# EAGLE design amp_schematic1 (EAGLE 9.0.1)
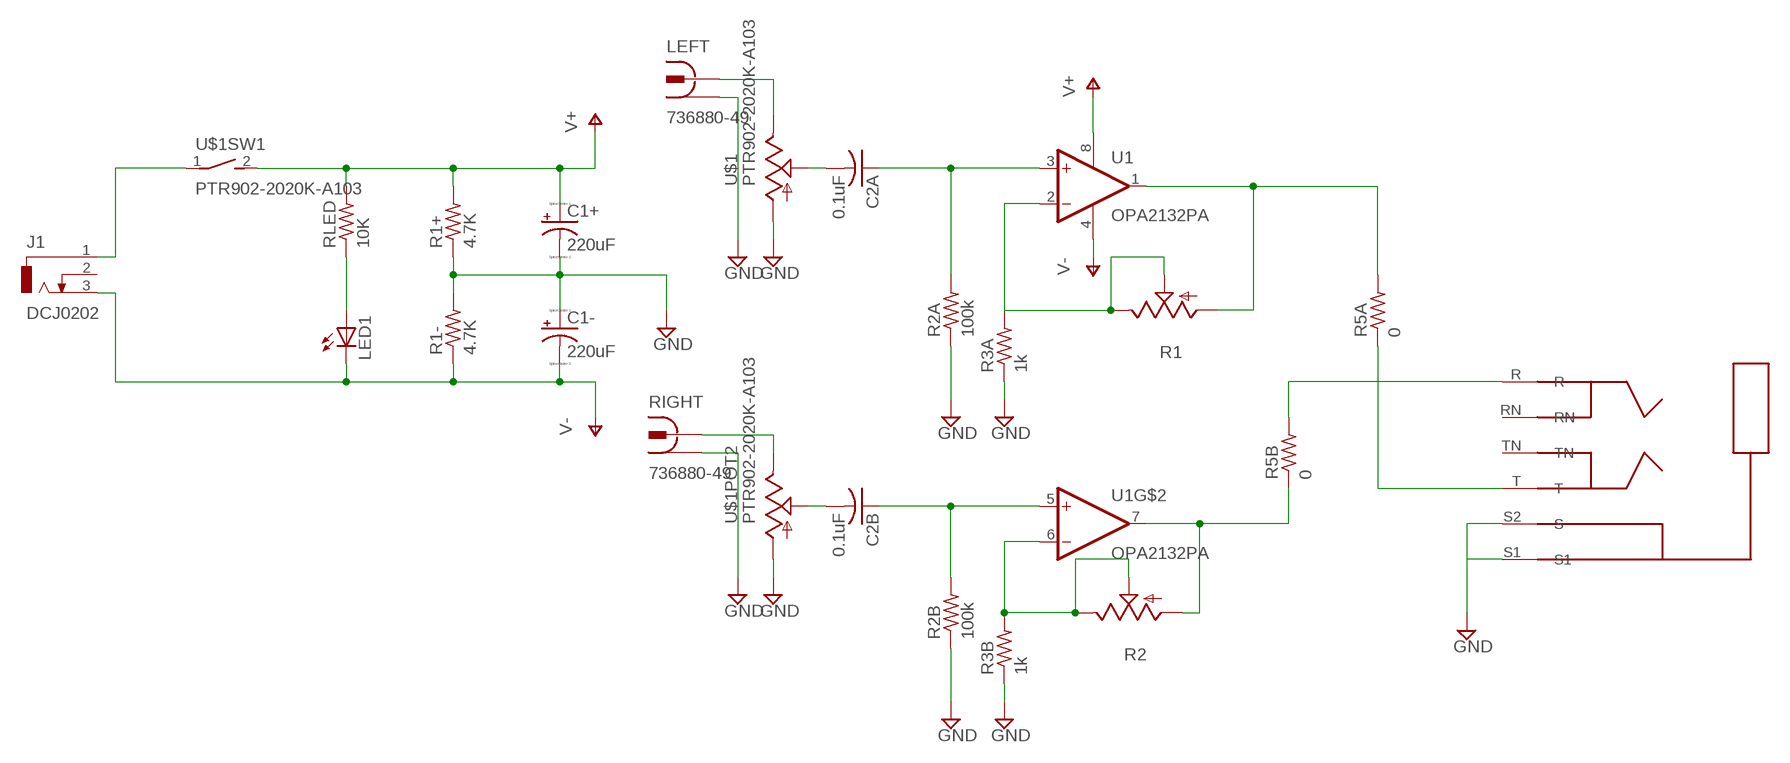
[diagram p0: schematic, sheet 1]

## Parts
C1+  220uF  CPOL-USE3.5-8  [E3,5-8]
C1-  220uF  CPOL-USE3.5-8  [E3,5-8]
C2A  0.1uF  C-US050-025X075  [C050-025X075]
C2B  0.1uF  C-US050-025X075  [C050-025X075]
J1  DCJ0202  [DCJ0202]
LED1  LED5MM  [LED5MM]
LEFT  736880-49  [736880-49]
R1  TRIM_US-B25U  [B25U]
R1+  4.7K  R-US_0204/2V  [0204V]
R1-  4.7K  R-US_0204/2V  [0204V]
R2  TRIM_US-B25U  [B25U]
R2A  100k  R-US_0204/2V  [0204V]
R2B  100k  R-US_0204/2V  [0204V]
R3A  1k  R-US_0204/2V  [0204V]
R3B  1k  R-US_0204/2V  [0204V]
R5A  0  R-US_0204/2V  [0204V]
R5B  0  R-US_0204/2V  [0204V]
RIGHT  736880-49  [736880-49]
RLED  10K  R-US_0204/2V  [0204V]
U1  OPA2132PA  [DIP254P762X508-8]
U$1  PTR902-2020K-A103  [PTR902]
U$2  STEROJACK  [STEREOJACK]

## Nets
GND: C1+.- C1-.+ LEFT.1 LEFT.1@1 LEFT.1@2 R1+.1 R1-.2 R2A.1 R2B.1 R3A.1 R3B.1 RIGHT.1 RIGHT.1@1 RIGHT.1@2 U$1.1A(A) U$1.1B(A) U$2.S1 U$2.S2(S)
N$1: LED1.A RLED.1
N$2: C2A.2 U$1.2A(S)
N$3: C2B.1 R2B.2 U1.5(+INB)
N$4: C2A.1 R2A.2 U1.3(+INA)
N$5: R1.E R1.S R3A.2 U1.2(-INA)
N$6: C2B.2 U$1.2B(S)
N$7: R2.E R2.S R3B.2 U1.6(-INB)
N$8: LEFT.2 U$1.3A(E)
N$9: R5B.2 U$2.R
N$10: RIGHT.2 U$1.3B(E)
N$11: R5A.1 U$2.T
N$13: R2.A R5B.1 U1.7(OUTB)
N$15: R1.A R5A.2 U1.1(OUTA)
SW1: J1.1 U$1.1(P)
V+: C1+.+ R1+.2 RLED.2 U1.8(V+) U$1.2(S)
V-: C1-.- J1.3 LED1.K(C) R1-.1 U1.4(V-)
Unconnected: J1.2 U$2.RN U$2.TN

## Library data of the parts
C1+ C1- = resistor:CPOL-US: POLARIZED CAPACITOR, American symbol
C2A C2B = rcl:C-US: CAPACITOR, American symbol; SPICEPREFIX: C
J1 = con-jack:DCJ0202: DC POWER JACK Source: DCJ0202.pdf; OC_FARNELL: unknown; OC_NEWARK: unknown
LED1 = led:LED: LED OSRAM: - CHIPLED LG R971, LG N971, LY N971, LG Q971, LY Q971, LO R971, LY R971 LH N974, LH R974 LS Q976, LO Q976, LY Q976 LO Q996 - Hyper CHIPLED LW Q18S LB Q993, LB Q99A, LB R99A - SideLED LS A670, LO A670, LY A670, LG A670, LP A670 LB A673, LV A673, LT A673, LW A673 LH A674 LY A675 LS A676, LA A676, LO A676, LY A676, LW A676 LS A679, LY A679, LG A679 - Hyper Micro SIDELED® LS Y876, LA Y876, LO Y876, LY Y876 LT Y87S - SmartLED LW L88C, LW L88S LB L89C, LB L89S, LG L890 LS L89K, LO L89K, LY L89K LS L896, LA L896, LO L896, LY L896 - TOPLED LS T670, LO T670, LY T670, LG T670, LP T670 LSG T670, LSP T670, LSY T670, LOP T670, LYG T670 LG T671, LOG T671, LSG T671 LB T673, LV T673, LT T673, LW T673 LH T674 LS T676, LA T676, LO T676, LY T676, LB T676, LH T676, LSB T676, LW T676 LB T67C, LV T67C, LT T67C, LS T67K, LO T67K, LY T67K, LW E67C LS E67B, LA E67B, LO E67B, LY E67B, LB E67C, LV E67C, LT E67C LW T67C LS T679, LY T679, LG T679 LS T770, LO T770, LY T770, LG T770, LP T770 LB T773, LV T773, LT T773, LW T773 LH T774 LS E675, LA E675, LY E675, LS T675 LS T776, LA T776, LO T776, LY T776, LB T776 LHGB T686 LT T68C, LB T68C - Hyper Mini TOPLED® LB M676 - Mini TOPLED Santana® LG M470 LS M47K, LO M47K, LY M47K Source: http://www.osram.convergy.de LUXEON: - LUMILED® LXK2-PW12-R00, LXK2-PW12-S00, LXK2-PW14-U00, LXK2-PW14-V00 LXK2-PM12-R00, LXK2-PM12-S00, LXK2-PM14-U00 LXK2-PE12-Q00, LXK2-PE12-R00, LXK2-PE12-S00, LXK2-PE14-T00, LXK2-PE14-U00 LXK2-PB12-K00, LXK2-PB12-L00, LXK2-PB12-M00, LXK2-PB14-N00, LXK2-PB14-P00, LXK2-PB14-Q00 LXK2-PR12-L00, LXK2-PR12-M00, LXK2-PR14-Q00, LXK2-PR14-R00 LXK2-PD12-Q00, LXK2-PD12-R00, LXK2-PD12-S00 LXK2-PH12-R00, LXK2-PH12-S00 LXK2-PL12-P00, LXK2-PL12-Q00, LXK2-PL12-R00 Source: www.luxeon.com KINGBRIGHT: KA-3528ASYC Source: www.kingbright.com
LEFT RIGHT = con-conrad:736880-49: Cinch Connector ( RCA Jack ) Cinch-Einbaukupplung 90º 72345 Vernickelt BKL Electronic Source: Conrad <http://www.conrad.de/ce/de/product/736880>
R1 R2 = pot:TRIM_US-: POTENTIOMETER
R1+ R1- R2A R2B R3A R3B R5A R5B RLED = resistor:R-US_: RESISTOR, American symbol
U1 = OPA2132PA:OPA2132PA: OPERATIONAL AMPLIFIER; DESCRIPTION: Operational amplifier; 8MHz; 2.5÷18VDC; Channels: 2; DIP8; DIGI-KEY_PART_NUMBER: OPA2132PA-ND; DIGI-KEY_PURCHASE_URL: https://www.digikey.com/product-detail/en/texas-instruments/OPA2132PA/OPA2132PA-ND/301149?utm_source=snapeda&utm_medium=aggregator&utm_campaign=symbol; MF: Texas Instruments; MP: OPA2132PA; PACKAGE: PDIP-8 Texas Instruments
U$1 = OPA2132PA:PTR902-2020K-A103
U$2 = OPA2132PA:STEROJACK

## Board
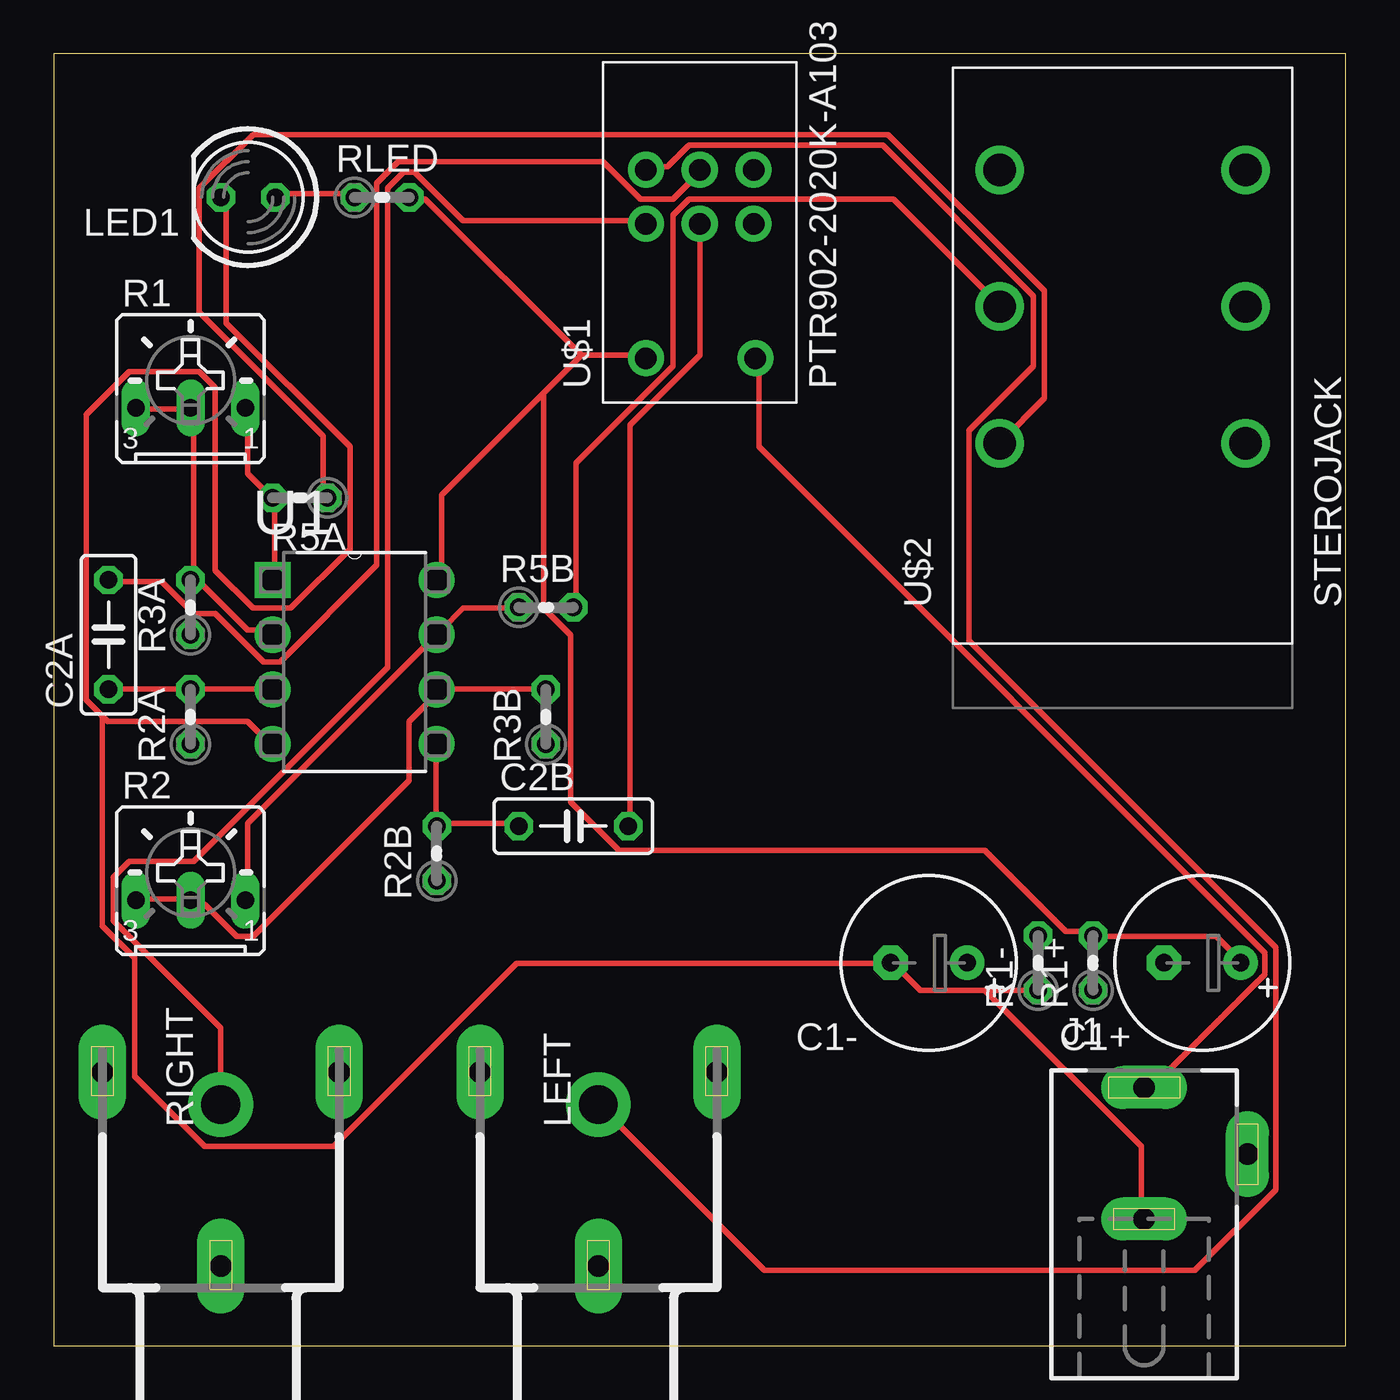
[diagram p1: board, top side]
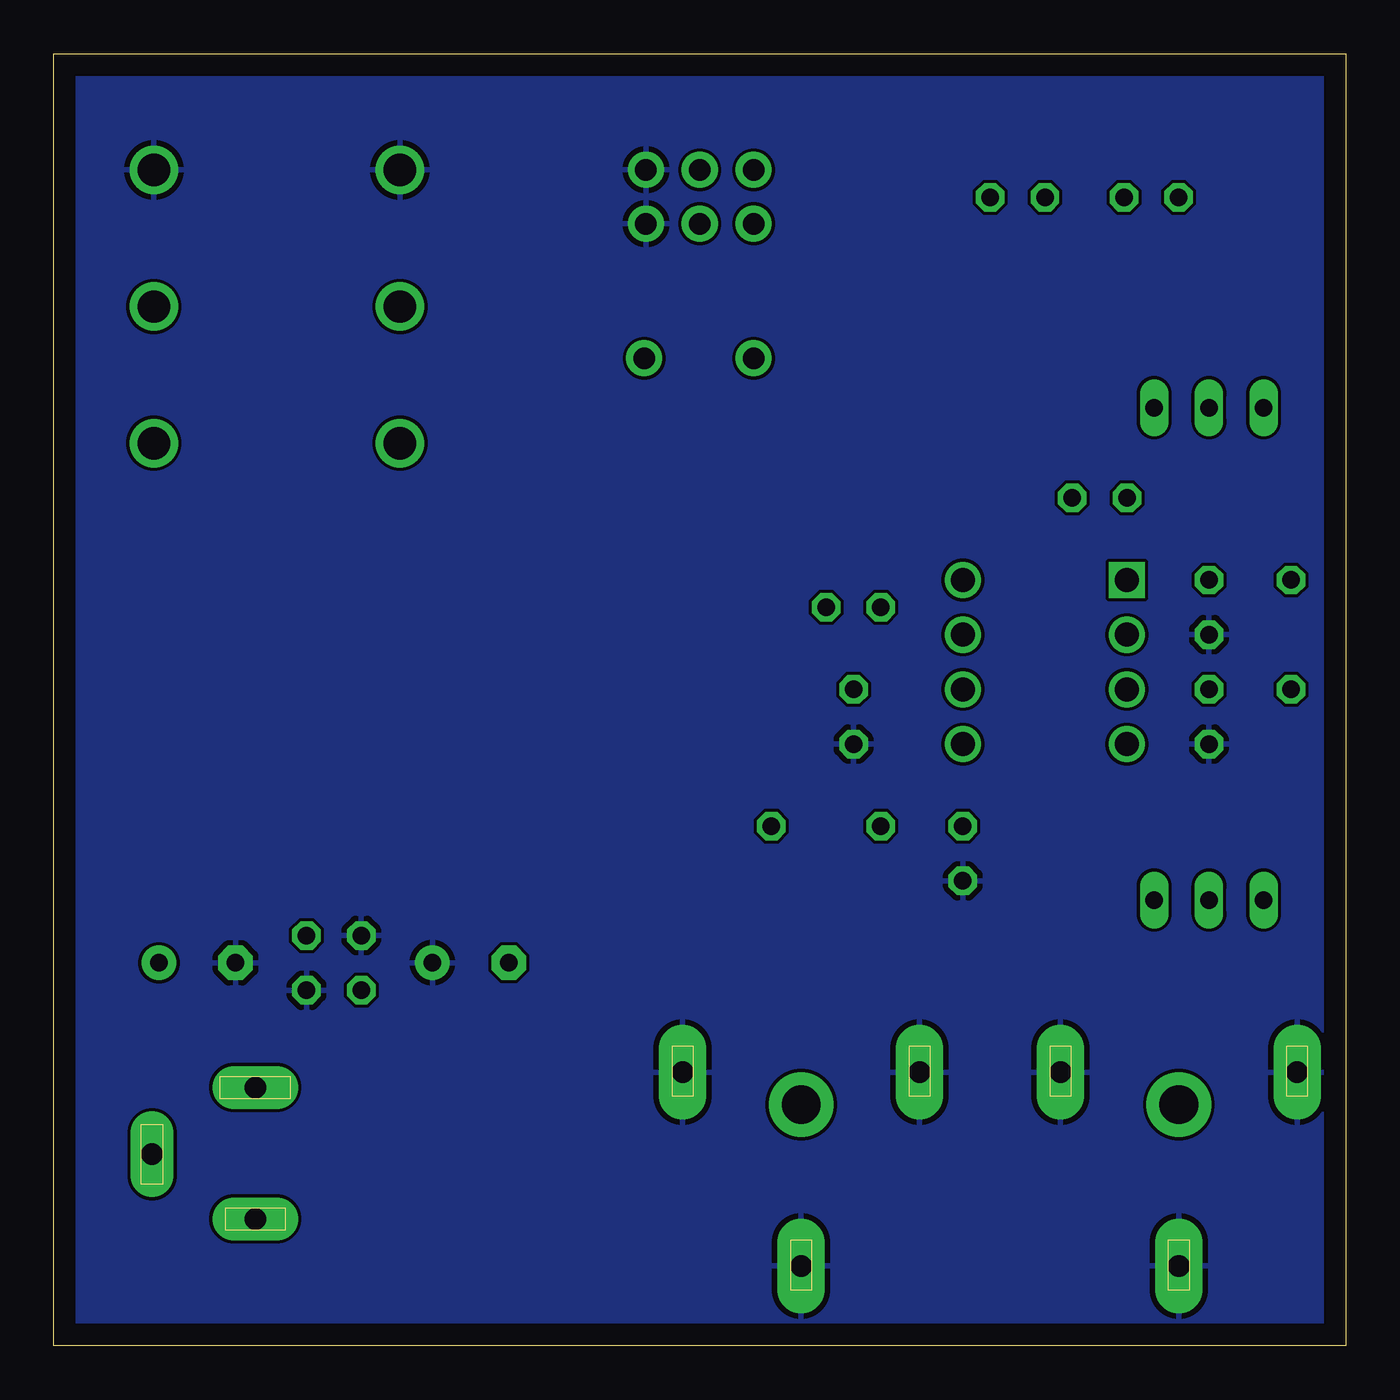
[diagram p2: board, bottom side, seen from below]

Size 60 x 60 mm. Coordinates in mm from the lower left corner, seen from the top.
Outline: 0,0 60,0 60,60 0,60 0,0
Copper layers (1*16): Top 0.035mm / dielectric 1.5mm / Bottom 0.035mm
Design rules "default *": minimum track width 10mil, minimum drill 0.35mm, track to track 6mil, track to pad 6mil, pad to pad 6mil, via to via 6mil, smd to smd 6mil, copper to edge 40mil, drill to drill 6mil, minimum pad ring 10mil, minimum via ring 8mil, stop-mask expansion 4mil, vias tented up to drill 0mil, thermal gap 10mil

### Footprints (pad centres in the part's own frame; a part is rotated, then mirrored left to right if it is on the bottom)
E3,5-8 = drill 0.813 pad 1.6: + -1.778,0 | drill 0.813 pad 1.6 octagon: - 1.778,0
C050-025X075 = drill 0.813 octagon: 1 -2.54,0; 2 2.54,0
DCJ0202 = drill 1 pad 2 long: 1 0,3.1; 2 4.8,0; 3 0,-3
LED5MM = drill 0.813 octagon: A -1.27,0; K 1.27,0
736880-49 = drill 1 pad 2.2 long: 1 -3.92,0; 1@1 5.08,-5.5; 1@2 5.08,5.5 | drill 1.8 pad 3: 2 3.58,0
B25U = drill 0.813 long: A 2.54,-0.889; E -2.54,-0.889; S 0,-0.889
0204V = drill 0.813 octagon: 1 -1.27,0; 2 1.27,0
DIP254P762X508-8 = drill 1.118 square: 1 -7.62,7.62 | drill 1.118: 2 -7.62,5.08; 3 -7.62,2.54; 4 -7.62,0; 5 0,0; 6 0,2.54; 7 0,5.08; 8 0,7.62
PTR902 = drill 1 pad 1.676: 1 -8.75,-2.58; 1A 0,-2.5; 1B -2.5,-2.5; 2 -8.75,2.5; 2A 0,0; 2B -2.5,0; 3A 0,2.5; 3B -2.5,2.5
STEREOJACK = drill 1.5 pad 2.184: R -6.35,5.715; RN -6.35,-5.715; S1 0,-5.715; S2 0,5.715; T -12.7,5.715; TN -12.7,-5.715

### Placement (x,y rotation side)
C1+  53.34,17.78 180 top
C1-  40.64,17.78 180 top
C2A  2.54,33.02 90 top
C2B  24.13,24.13 0 top
J1  50.64,8.89 0 top
LED1  9.03,53.34 180 top
LEFT  25.29,7.62 90 top
R1  6.35,44.45 0 top
R1+  48.26,17.78 90 top
R1-  45.72,17.78 90 top
R2  6.35,21.59 0 top
R2A  6.35,29.21 90 top
R2B  17.78,22.86 90 top
R3A  6.35,34.29 90 top
R3B  22.86,29.21 90 top
R5A  11.43,39.37 180 top
R5B  22.86,34.29 0 top
RIGHT  7.75,7.62 90 top
RLED  15.24,53.34 0 top
U1  17.78,27.94 0 top
U$1  30,54.61 90 top
U$2  49.64,54.61 90 top

### Tracks (layer width: path | path; a pad name or v marks a point on that pad's centre or on a via)
GND
  pour Bottom: 0,59.69 0,0 59.69,0 59.69,59.69
N$1
  Top 0.254: LED1.A 10.5,53.5 13.75,53.5 RLED.1
N$2
  Top 0.254: C2A.2 2.75,35.5 5,35.5 6.5,34 7.5,34 9.75,31.75 10.5,31.75 15,36.25 15,54 16,55 25.5,55 27.25,53.25 28.75,53.25 30,54.5 U$1.2A
N$3
  Top 0.254: U1.5 17.75,27.75 17.75,24.25 R2B.2 18,24.25 21.5,24.25 C2B.1
N$4
  Top 0.254: C2A.1 2.75,30.5 6.25,30.5 R2A.2 6.5,30.5 10,30.5 U1.3
N$5
  Top 0.254: 6.5,35.75 6.5,43.5 R1.S 6.25,43.5 4,43.5 R1.E | 6.5,35.75 9,33.25 10,33.25 U1.2 | 6.5,35.75 R3A.2
N$6
  Top 0.254: U$1.2B 30,46 26.75,42.75 26.75,24.25 C2B.2
N$7
  Top 0.254: R2.E 4,20.75 6.25,20.75 R2.S 6.5,20.5 7,20.5 8.5,19 9.25,19 16.5,26.25 16.5,29 17.75,30.25 U1.6 18,30.5 22.75,30.5 R3B.2
N$8
  Top 0.254: U$1.3A 27.5,54.75 28.5,54.75 29.5,55.75 38.5,55.75 45.5,48.75 45.5,45.5 42.5,42.5 42.5,32.75 56.75,18.5 56.75,7.25 53,3.5 33,3.5 25.5,11 LEFT.2
N$9
  Top 0.254: R5B.2 24.25,34.5 24.25,41 28.75,45.5 28.75,52.5 29.5,53.25 39,53.25 43.75,48.5 U$2.R
N$10
  Top 0.254: RIGHT.2 7.75,14.75 2.75,19.75 2.75,21.75 3.5,22.5 6.5,22.5 15.5,31.5 15.5,53.75 16.25,54.5 16.75,54.5 19,52.25 27.5,52.25 U$1.3B
N$11
  Top 0.254: R5A.1 12.5,39.5 12.5,42.25 6.75,48 6.75,53.75 9.25,56.25 38.75,56.25 46,49 46,44 44,42 U$2.T
N$13
  Top 0.254: R2.A 9,20.75 9,24.25 17.75,33 U1.7 18,33.25 19,34.25 21.5,34.25 R5B.1
N$15
  Top 0.254: U1.1 10.25,35.75 10.25,39.25 R5A.2 10,39.5 9,40.5 9,43.5 R1.A
SW1
  Top 0.254: U$1.1 32.75,45.75 32.75,41.75 56.25,18.25 56.25,17.25 50.75,11.75 J1.1
V+
  Top 0.254: C1+.+ 55,18 54,19 48.5,19 R1+.2 48.25,19.25 47,19.25 43.25,23 26.25,23 24,25.25 24,33 22.75,34.25 22.75,44.25 | 24.5,46 17.25,53.25 16.75,53.25 RLED.2 | 24.5,46 27.5,46 U$1.2 | 24.5,46 22.75,44.25 | 22.75,44.25 18,39.5 18,35.75 U1.8
V-
  Top 0.254: 43.25,16.5 40.25,16.5 39,17.75 C1-.- 38.75,17.75 21.5,17.75 13,9.25 7,9.25 3.75,12.5 3.75,18 2.25,19.5 2.25,29.25 | 43.25,16.5 45.5,16.5 R1-.1 | 43.25,16.5 50.5,9.25 50.5,6 J1.3 | 2.25,29.25 2.5,29 9,29 10,28 U1.4 | 2.25,29.25 1.5,30 1.5,43.25 3.5,45.25 6.75,45.25 7.5,44.5 7.5,36 9.25,34.25 11,34.25 13.75,37 13.75,41.75 8,47.5 8,53.25 LED1.K